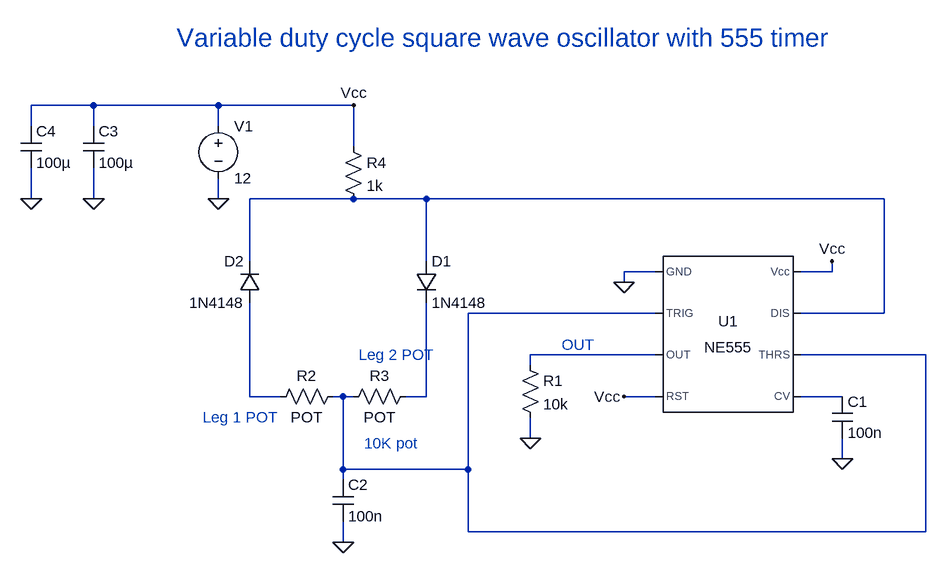
[diagram p0: schematic Adjustable-duty-cycle-555-square-wave-oscillator.asc]
Adjustable-duty-cycle-555-square-wave-oscillator.asc, the LTspice schematic file:
Version 4.1
SHEET 1 1012 680
WIRE -768 -176 -864 -176
WIRE -576 -176 -768 -176
WIRE -368 -176 -576 -176
WIRE -864 -144 -864 -176
WIRE -768 -144 -768 -176
WIRE -576 -144 -576 -176
WIRE -368 -112 -368 -176
WIRE -864 -32 -864 -80
WIRE -768 -32 -768 -80
WIRE -576 -32 -576 -64
WIRE -368 -32 -528 -32
WIRE -256 -32 -368 -32
WIRE 448 -32 -256 -32
WIRE -528 64 -528 -32
WIRE -256 64 -256 -32
WIRE 96 80 48 80
WIRE 368 80 368 64
WIRE 368 80 320 80
WIRE 48 96 48 80
WIRE 96 144 -192 144
WIRE 448 144 448 -32
WIRE 448 144 320 144
WIRE 96 208 -96 208
WIRE 512 208 320 208
WIRE -96 224 -96 208
WIRE -528 272 -528 128
WIRE -480 272 -528 272
WIRE -384 272 -400 272
WIRE -368 272 -384 272
WIRE -256 272 -256 128
WIRE -256 272 -288 272
WIRE 96 272 48 272
WIRE 384 272 320 272
WIRE -96 336 -96 304
WIRE 384 368 384 336
WIRE -384 384 -384 272
WIRE -192 384 -192 144
WIRE -192 384 -384 384
WIRE -384 400 -384 384
WIRE -192 480 -192 384
WIRE 512 480 512 208
WIRE 512 480 -192 480
WIRE -384 496 -384 464
FLAG 48 96 0
FLAG -384 496 0
FLAG -576 -32 0
FLAG -368 -176 Vcc
FLAG 368 64 Vcc
FLAG 48 272 Vcc
FLAG -96 336 0
FLAG 384 368 0
FLAG -864 -32 0
FLAG -768 -32 0
SYMBOL Misc\\NE555 208 176 R0
SYMATTR InstName U1
SYMBOL voltage -576 -160 R0
WINDOW 123 0 0 Left 0
WINDOW 39 0 0 Left 0
SYMATTR InstName V1
SYMATTR Value 12
SYMBOL res -112 208 R0
SYMATTR InstName R1
SYMATTR Value 10k
SYMBOL cap 368 272 R0
SYMATTR InstName C1
SYMATTR Value 100n
SYMBOL diode -272 64 R0
SYMATTR InstName D1
SYMATTR Value 1N4148
SYMBOL diode -512 128 R180
WINDOW 0 24 64 Left 2
WINDOW 3 24 0 Left 2
SYMATTR InstName D2
SYMATTR Value 1N4148
SYMBOL res -384 256 R90
WINDOW 0 0 56 VBottom 2
WINDOW 3 32 56 VTop 2
SYMATTR InstName R2
SYMATTR Value POT
SYMBOL res -272 256 R90
WINDOW 0 0 56 VBottom 2
WINDOW 3 32 56 VTop 2
SYMATTR InstName R3
SYMATTR Value POT
SYMBOL cap -400 400 R0
SYMATTR InstName C2
SYMATTR Value 100n
SYMBOL res -384 -128 R0
SYMATTR InstName R4
SYMATTR Value 1k
SYMBOL cap -784 -144 R0
SYMATTR InstName C3
SYMATTR Value 100µ
SYMBOL cap -880 -144 R0
SYMATTR InstName C4
SYMATTR Value 100µ
TEXT -600 304 Left 2 ;Leg 1 POT
TEXT -360 208 Left 2 ;Leg 2 POT
TEXT -640 -280 Left 4 ;Variable duty cycle square wave oscillator with 555 timer
TEXT -48 192 Left 2 ;OUT
TEXT -352 344 Left 2 ;10K pot

The netlist it stands for:
* Adjustable-duty-cycle-555-square-wave-oscillator.asc
X§U1 0 N002 N003 Vcc N006 N002 N001 Vcc NE555  ; pins GND TRIG OUT RST CV THRS DIS Vcc
V1 Vcc 0 12
R1 N003 0 10k
C1 N006 0 100n
D1 N001 N005 1N4148
D2 N004 N001 1N4148
R2 N002 N004 POT
R3 N005 N002 POT
C2 N002 0 100n
R4 Vcc N001 1k
C3 Vcc 0 100µ
C4 Vcc 0 100µ
.model D D
.lib standard.dio
* Leg 1 POT
* Leg 2 POT
* Variable duty cycle square wave oscillator with 555 timer
* OUT
* 10K pot
.lib NE555.sub
.backanno
.end